# EAGLE schematic flight-controller (EAGLE 7.4.0)
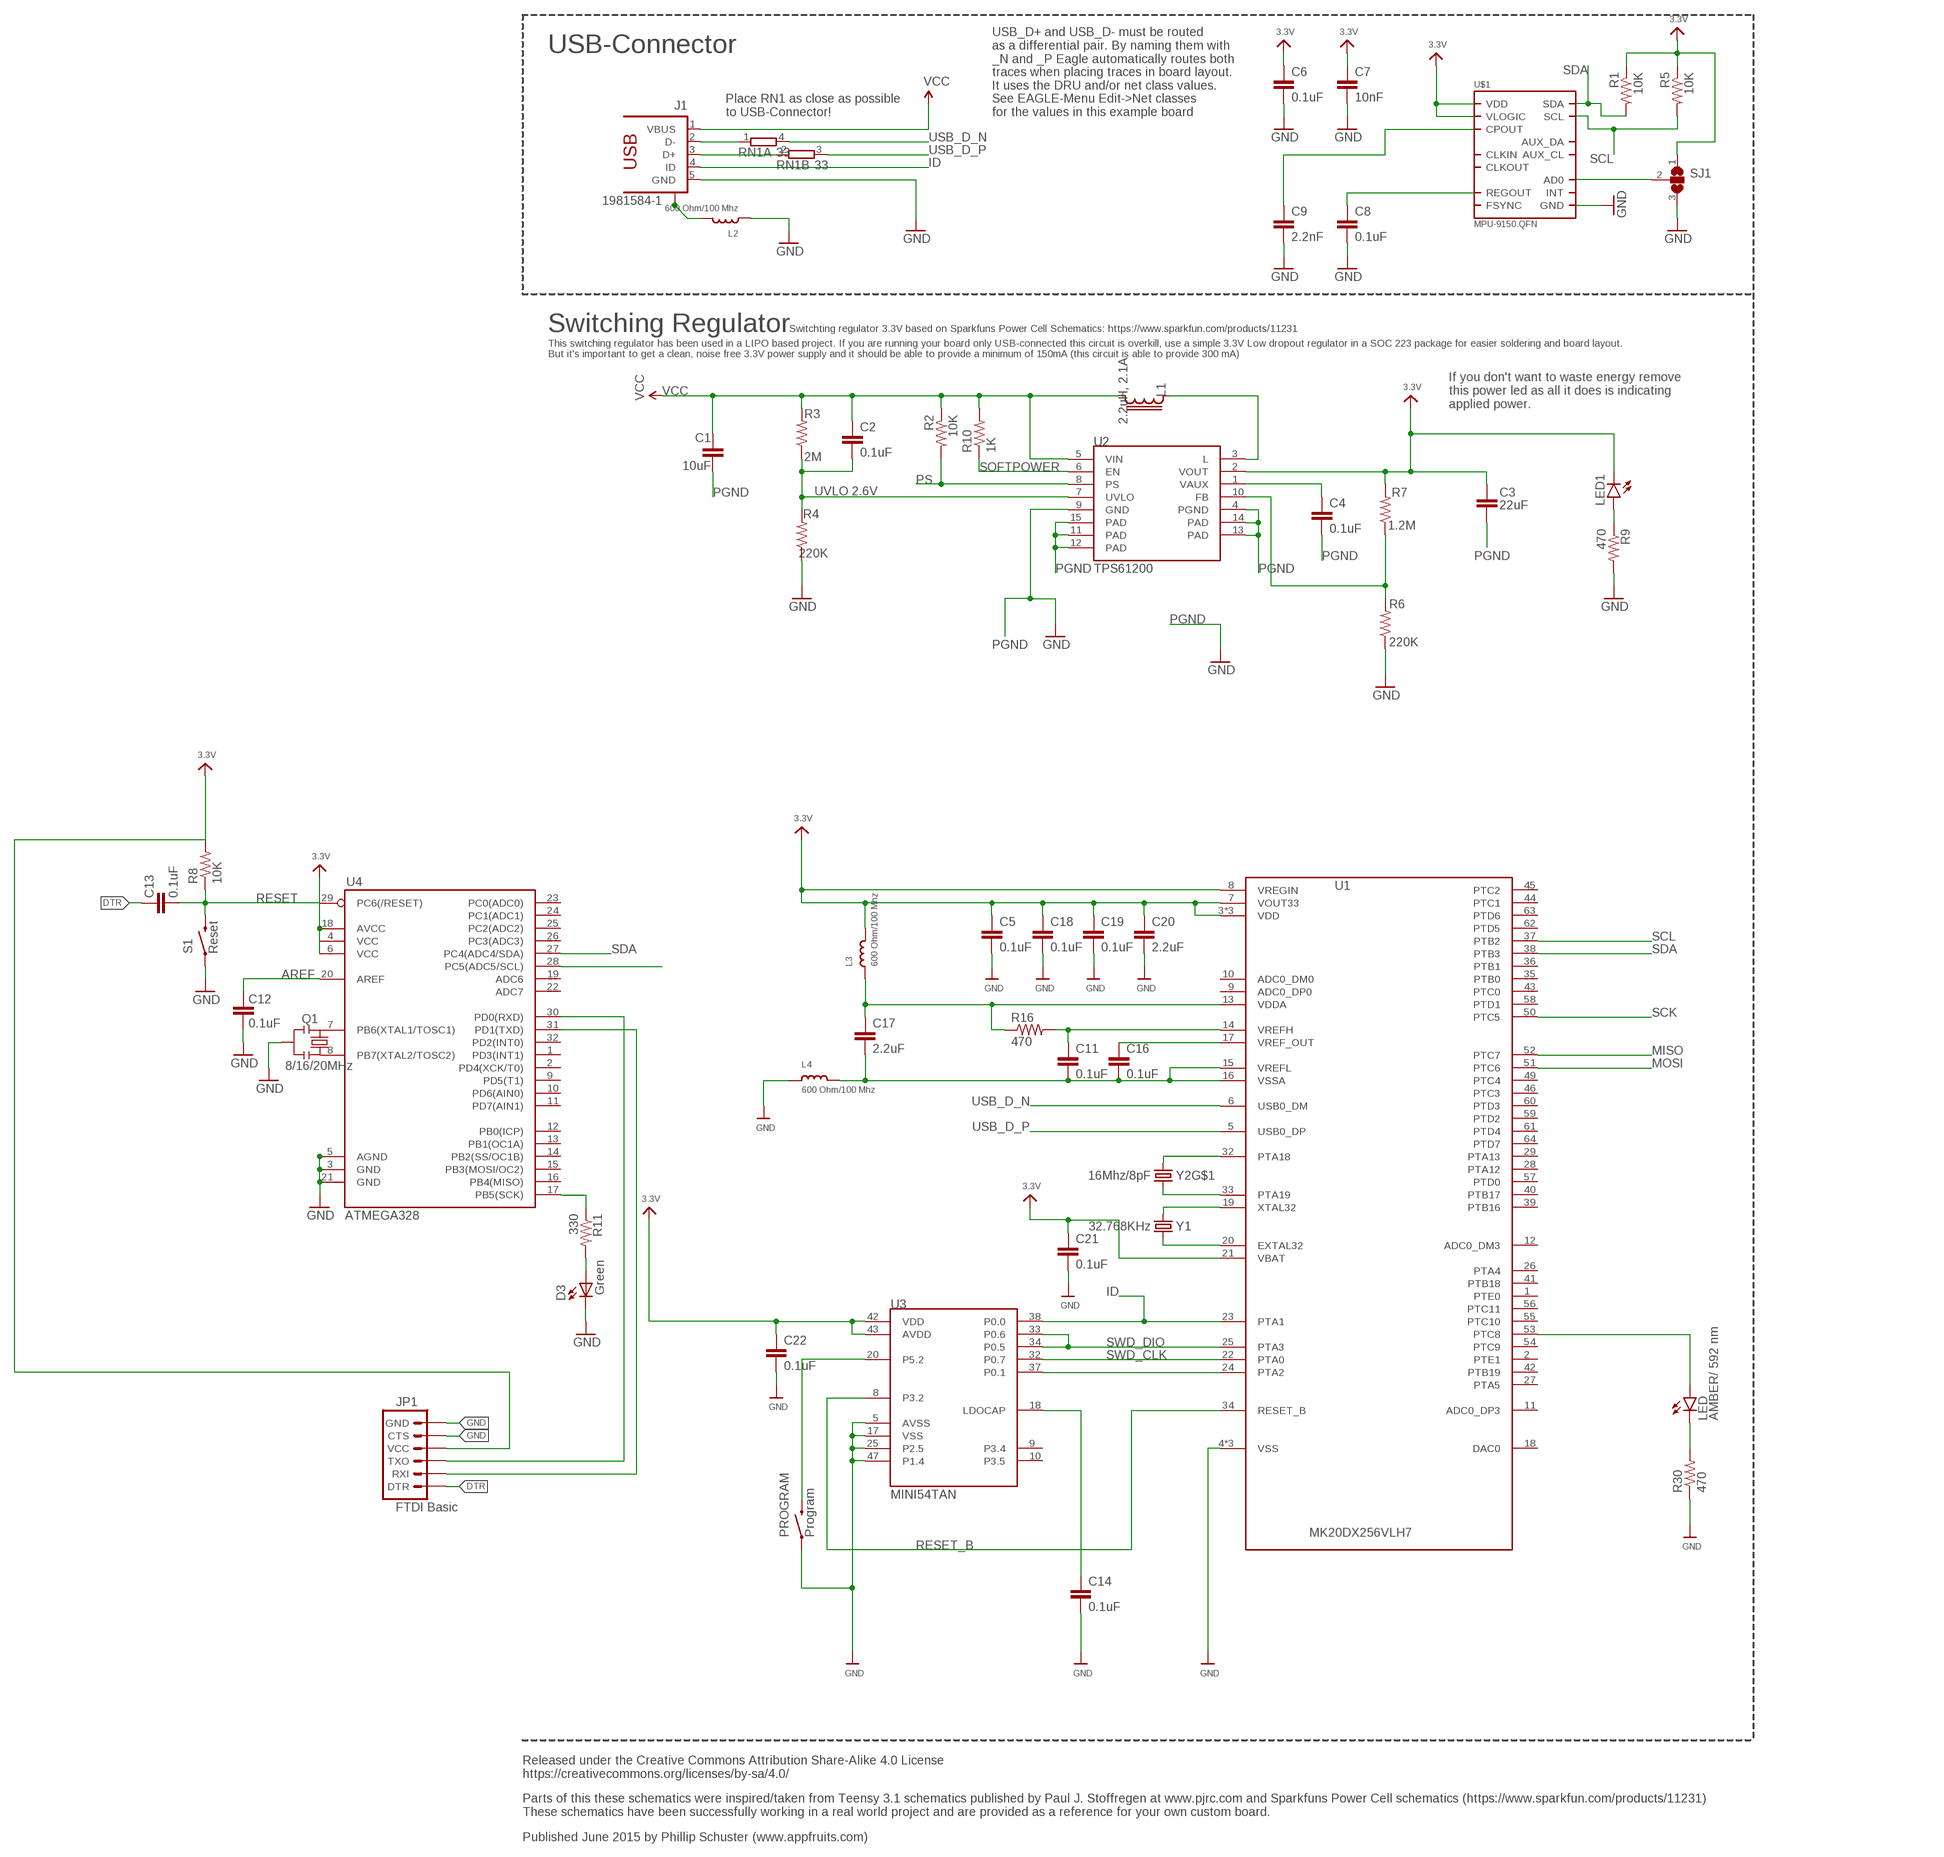
[diagram p0: schematic, sheet 1]

## Parts
C1  10uF  CAPACITOR-10UF  [0603-CAP]
C2  0.1uF  CAPACITOR-0.1UF  [0603-CAP]
C3  22uF  CAPACITOR-22UF  [0603-CAP]
C4  0.1uF  CAPACITOR-0.1UF  [0603-CAP]
C5  0.1uF  CAPACITOR-0.1UF  [0603-CAP]
C6  0.1uF  CAPACITOR-0.1UF  [0603-CAP]
C7  10nF  CAPACITOR-0.1UF  [0603-CAP]
C8  0.1uF  CAPACITOR-0.1UF  [0603-CAP]
C9  2.2nF  CAPACITOR-0.1UF  [0603-CAP]
C11  0.1uF  CAPACITOR-0.1UF  [0603-CAP]
C12  0.1uF  CAP0603-CAP  [0603-CAP]
C13  0.1uF  CAP0603-CAP  [0603-CAP]
C14  0.1uF  CAPACITOR-0.1UF  [0603-CAP]
C16  0.1uF  CAPACITOR-0.1UF  [0603-CAP]
C17  2.2uF  CAPACITOR-2.2UF  [0603-CAP]
C18  0.1uF  CAPACITOR-0.1UF  [0603-CAP]
C19  0.1uF  CAPACITOR-0.1UF  [0603-CAP]
C20  2.2uF  CAPACITOR-2.2UF  [0603-CAP]
C21  0.1uF  CAPACITOR-0.1UF  [0603-CAP]
C22  0.1uF  CAPACITOR-0.1UF  [0603-CAP]
D3  Green  LED  [0603-LED-ALT1]
J1  1981584-1  [1981584-1]
JP1  FTDI Basic  ARDUINO_SERIAL_PROGRAMPTH  [1X06]
L1  2.2uH, 2.1A  LPS30152.2UH  [LPS3015]
L2  600 Ohm/100 Mhz  INDUCTOR-BK2125HM601-T  [0805]
L3  600 Ohm/100 Mhz  INDUCTOR-BK2125HM601-T  [0805]
L4  600 Ohm/100 Mhz  INDUCTOR-BK2125HM601-T  [0805]
LED  AMBER/ 592 nm  LED-AMBER  [LED-0603]
LED1  LED-GREEN  [LED-0603]
PROGRAM  Program  SWITCH-MOMENTARY-2-SMD-1101NE  [TACTILE-SWITCH-1101NE]
Q1  8/16/20MHz  RESONATOR1:1  [RESONATOR-SMD-1:1]
R1  10K  RESISTOR-10K  [0603-RES]
R2  10K  RESISTOR-10K  [0603-RES]
R3  2M  RESISTOR-2M  [0603-RES]
R4  220K  RESISTOR-220K  [0603-RES]
R5  10K  RESISTOR-10K  [0603-RES]
R6  220K  RESISTOR-220K  [0603-RES]
R7  1.2M  RESISTOR-1.2M  [0603-RES]
R8  10K  RESISTOR0603-RES  [0603-RES]
R9  470  RESISTOR-470  [0603-RES]
R10  1K  RESISTOR-1K  [0603-RES]
R11  330  RESISTOR0603-RES  [0603-RES]
R16  470  RESISTOR-470  [0603-RES]
R30  470  RESISTOR-470  [0603-RES]
RN1  33  2R-NEXB34V  [EXB34V]
S1  Reset  SWITCH-MOMENTARY-2SMD-ALT01  [TACTILE-SWITCH-SMD-ALT01]
SJ1  SJ2W  [SJ_2]
U1  MK20DX256VLH7  [MK20DX256VLH7]
U2  TPS61200  [QFN-10_PAD]
U3  MINI54TAN  [MINI54TAN]
U4  ATMEGA328  ATMEGA168  [TQFP32-08]
U$1  MPU-9150.QFN  [QFN.24.4X4]
Y1  32.768KHz  CRYSTAL/32.768KHZ/SMD-TXC_7A  [CRYSTAL-TXC-7A]
Y2  16Mhz/8pF  CRYSTAL/SMD-5X3-GND16MHZ/8PF  [CRYSTAL-SMD-5X3]

## Nets
3.3V: C3.1 C5.1 C6.1 C7.1 C18.1 C19.1 C20.1 C21.1 C22.1 JP1.4(VCC) L3.2 LED1.C R1.1 R5.1 R7.2 R8.2 SJ1.1 U1.3(VDD) U1.7(VOUT33) U1.8(VREGIN) U1.21(VBAT) U1.30(VDD) U1.48(VDD) U2.2(VOUT) U3.42(VDD) U3.43(AVDD) U4.4(VCC) U4.6(VCC) U4.18(AVCC) U$1.3(VDD) U$1.8(VLOGIC) U$1.13(VDD)
AREF: C12.2 U4.20(AREF)
DTR: C13.2 JP1.1(DTR)
FB: R6.2 R7.1 U2.10(FB)
GND [Top GND Pour]: C5.2 C6.2 C7.2 C8.2 C9.2 C12.1 C14.2 C18.2 C19.2 C20.2 C21.2 C22.2 D3.C J1.5(GND) JP1.5(CTS) JP1.6(GND) L2.1 L4.1 PROGRAM.P$1 Q1.2 R4.1 R6.1 R9.2 R30.1 S1.1 S1.2 SJ1.3 U1.4(VSS) U1.31(VSS) U1.47(VSS) U3.5(AVSS) U3.17(VSS) U3.25(P2.5) U3.47(P1.4) U4.3(GND) U4.5(AGND) U4.21(GND) U$1.15(GND) U$1.17(GND) U$1.18(GND)
ID: J1.4(ID) U1.23(PTA1) U3.38(P0.0)
MISO: U1.52(PTC7)
MOSI: U1.51(PTC6)
N$1: LED1.A R9.1
N$2: L1.1 U2.3(L)
N$3: C9.1 U$1.20(CPOUT)
N$4: C8.1 U$1.10(REGOUT)
N$5: SJ1.2 U$1.9(AD0)
N$6: Q1.3 U4.8(PB7(XTAL2/TOSC2))
N$7: D3.A R11.2
N$8: Q1.1 U4.7(PB6(XTAL1/TOSC1))
N$9: JP1.3(TXO) U4.30(PD0(RXD))
N$10: JP1.2(RXI) U4.31(PD1(TXD))
N$12: LED.A U1.53(PTC8)
N$15: U1.24(PTA2) U3.37(P0.1)
N$18: LED.C R30.2
N$19: PROGRAM.P$2 U3.20(P5.2)
N$22: C14.1 U3.18(LDOCAP)
N$27: U1.32(PTA18) Y2.3
N$28: U1.33(PTA19) Y2.1
N$29: U1.19(XTAL32) Y1.P$2
N$30: U1.20(EXTAL32) Y1.P$1
NONE: R11.1 U4.17(PB5(SCK))
PGND: C1.2 C3.2 C4.2 U2.4(PGND) U2.9(GND) U2.11(PAD) U2.12(PAD) U2.13(PAD) U2.14(PAD) U2.15(PAD) ; supply symbol labelled GND
PS: R2.2 U2.8(PS)
RESET: C13.1 R8.1 S1.3 S1.4 U4.29(PC6(/RESET))
RESET_B: U1.34(RESET_B) U3.8(P3.2)
SCK: U1.50(PTC5)
SCL: R5.2 U1.37(PTB2) U4.28(PC5(ADC5/SCL)) U$1.23(SCL)
SDA: R1.2 U1.38(PTB3) U4.27(PC4(ADC4/SDA)) U$1.24(SDA)
SOFTPOWER: R10.1 U2.6(EN)
SWD_CLK: U1.22(PTA0) U3.32(P0.7)
SWD_DIO: U1.25(PTA3) U3.33(P0.6) U3.34(P0.5)
USB_CON_N [USB]: J1.2(D-) RN1.1
USB_CON_P [USB]: J1.3(D+) RN1.2
USB_D_N [USB]: RN1.4 U1.6(USB0_DM)
USB_D_P [USB]: RN1.3 U1.5(USB0_DP)
USB_SHIELD: J1.S1 J1.S2 J1.S3 J1.S4 L2.2
UVLO: C2.2 R3.1 R4.2 U2.7(UVLO)
VAUX: C4.1 U2.1(VAUX)
VCC: C1.1 C2.1 J1.1(VBUS) L1.2 R2.1 R3.2 R10.2 U2.5(VIN)
VDDA: C17.1 L3.1 R16.1 U1.13(VDDA)
VREF_OUT: C16.1 U1.17(VREF_OUT)
VREFH: C11.1 R16.2 U1.14(VREFH)
VREFL: C11.2 C16.2 C17.2 L4.2 U1.15(VREFL) U1.16(VSSA)
Unconnected: U1.1(PTE0) U1.2(PTE1) U1.9(ADC0_DP0) U1.10(ADC0_DM0) U1.11(ADC0_DP3) U1.12(ADC0_DM3) U1.18(DAC0) U1.26(PTA4) U1.27(PTA5) U1.28(PTA12) U1.29(PTA13) U1.35(PTB0) U1.36(PTB1) U1.39(PTB16) U1.40(PTB17) U1.41(PTB18) U1.42(PTB19) U1.43(PTC0) U1.44(PTC1) U1.45(PTC2) U1.46(PTC3) U1.49(PTC4) U1.54(PTC9) U1.55(PTC10) U1.56(PTC11) U1.57(PTD0) U1.58(PTD1) U1.59(PTD2) U1.60(PTD3) U1.61(PTD4) U1.62(PTD5) U1.63(PTD6) U1.64(PTD7) U3.9(P3.4) U3.10(P3.5) U4.1(PD3(INT1)) U4.2(PD4(XCK/T0)) U4.9(PD5(T1)) U4.10(PD6(AIN0)) U4.11(PD7(AIN1)) U4.12(PB0(ICP)) U4.13(PB1(OC1A)) U4.14(PB2(SS/OC1B)) U4.15(PB3(MOSI/OC2)) U4.16(PB4(MISO)) U4.19(ADC6) U4.22(ADC7) U4.23(PC0(ADC0)) U4.24(PC1(ADC1)) U4.25(PC2(ADC2)) U4.26(PC3(ADC3)) U4.32(PD2(INT0)) U$1.1(CLKIN) U$1.6(AUX_DA) U$1.7(AUX_CL) U$1.11(FSYNC) U$1.12(INT) U$1.22(CLKOUT) Y2.2(GND:GND) Y2.4(GND:GND)

## Notes on the sheet
- USB-Connector
- Place RN1 as close as possible
  to USB-Connector!
- USB_D+ and USB_D- must be routed
  as a differential pair. By naming them with
  _N and _P Eagle automatically routes both
  traces when placing traces in board layout.
  It uses the DRU and/or net class values. 
  See EAGLE-Menu Edit->Net classes 
  for the values in this example board
- Switching Regulator | Switchting regulator 3.3V based on Sparkfuns Power Cell Schematics: https://www.sparkfun.com/products/11231
- This switching regulator has been used in a LIPO based project. If you are running your board only USB-connected this circuit is overkill, use a simple 3.3V Low dropout regulator in a SOC 223 package for easier soldering and board layout.
  But it's important to get a clean, noise free 3.3V power supply and it should be able to provide a minimum of 150mA (this circuit is able to provide 300 mA)
- If you don't want to waste energy remove
  this power led as all it does is indicating
  applied power.
- UVLO 2.6V
- Released under the Creative Commons Attribution Share-Alike 4.0 License
  https://creativecommons.org/licenses/by-sa/4.0/
- Parts of this these schematics were inspired/taken from Teensy 3.1 schematics published by Paul J. Stoffregen at www.pjrc.com and Sparkfuns Power Cell schematics (https://www.sparkfun.com/products/11231)
  These schematics have been successfully working in a real world project and are provided as a reference for your own custom board.
- Published June 2015 by Phillip Schuster (www.appfruits.com)

## Library data of the parts
C1 = appfruits:CAPACITOR; MF: Murata; MPN: GRM188R60J106ME47D
C2 C4-C6 C8 C11 C14 C16 C18 C19 C21 C22 = appfruits:CAPACITOR; MF: Kemet; MPN: C0603C104J3RACTU
C3 = appfruits:CAPACITOR; MF: Murata; MPN: GRM188R60J226MEA0D
C7 C9 = appfruits:CAPACITOR; MF: Kemet; MPN: C0603C104J3RACTU; VALUE: 0.1uF
C12 C13 = SparkFun:CAP: Capacitor Standard 0603 ceramic capacitor, and 0.1" leaded capacitor.
C17 C20 = appfruits:CAPACITOR; MF: Kemet; MPN: C0603C225K4PACTU
D3 = Testing:LED: LEDs Standard schematic elements and footprints for 5mm, 3mm, 1206, and 0603 sized LEDs. 5mm - Spark Fun Electronics SKU : COM-00529 (and others)
J1 = con-usb:1981584-1: Receptacle, micro-USB, type A/B Tyco Electronics; MF: Hirose; MPN: ZX62-AB-5PA(11)
JP1 = SparkFun:ARDUINO_SERIAL_PROGRAM
L1 = appfruits:LPS3015: Shielded Power Inductor; MF: Coilcraft; MPN: LPS3015-222MRB
L2-L4 = appfruits:INDUCTOR: Inductors 0603: 10nH Ceramic Inductor - microwire antenna/RF (Digikey: 712-1434-2-ND) 0805: 560nH Ceramic Inductor - RF (Digikey: 553-1047-1-ND) 270nH Ceramic Inductor - Q = 40@250MHz, +-5%, 1 Ohm DC Resistance (Digikey: 535-10506-2-ND) 1007 (2518 Metric) SMT: 10µH 10% 250mOhm 820mA 1007 Inductor (Digikey: 587-2189-1-ND) 22µH 10% 500mOhm 580mA 1007 Inductor (Digikey: 587-2190-1-ND) 47µH 10% 950mOhm 420mA 1007 Inductor (Digikey: 587-2191-1-ND) 47µH 5% 100mOhm 1A 1008 Inductor (Digikey: 732-1816-1-ND) 5.0x5.0mm (Taiyo Yuden NR5040 Series) 6.8µH 20% 2.3A 64mOhm Inductor (Digikey: 587-2374-2-ND) 5.0x5.0mm (TDK VLC5045 Series) 4.7µH 20% 3.3A 34mOhm Inductor (Digikey: 445-6526-1-ND) 6.8µH 20% 2.7A 46mOhm Inductor (Digikey: 445-6527-1-ND) 6.0x6.0mm (TDK VLC6045 Series) 4.7µH 20% 3.8A 27mOhm Inductor (Digikey: 445-6538-2-ND) 6.8µH 20% 3A 41mOhm Inductor (Digikey: 445-6540-1-ND) 6.2µH 30% 2.2A 45mOhm Inductor (Digikey: SRR5028-6R2YCT-ND) - Not TDK VLC6045 but footprint should match 6.0x6.0mm (TDK SLF6045 Series) 6.8uH 30% 2A 33mOhm Inductor (Digikey: 445-4572-1-ND, Mouser: 810-SLF645T6R8N2R0PF) 6.0x6.0mm (Sumida CDRH5D28 Series) 6.2uH 30% 1.8A 45mOhm Inductor (Digikey: 308-1542-1-ND) Taiyo Yuden NR3015T2R2M - 2.2uH 20% 1.5A (Digikey: 587-1648-2-ND, Mouser: 963-NR3015T2R2M) - Used with TI TPS62172 CoilCraft RFID Transponder Coil - MA5532-AE (For use with AS3935 Lightning Sensor); MF: Taiyo Yuden; MPN: BK2125HM601-T
LED = appfruits:LED: LEDs Standard schematic elements and footprints for 5mm, 3mm, 1206, and 0603 sized LEDs. 5mm - Spark Fun Electronics SKU : COM-00529 (and others); MF: Avago Technologies; MPN: HSMA-C190
LED1 = appfruits:LED: LEDs Standard schematic elements and footprints for 5mm, 3mm, 1206, and 0603 sized LEDs. 5mm - Spark Fun Electronics SKU : COM-00529 (and others); MF: Avago; MPN: HSMG-C190
PROGRAM = SparkFun-Electromechanical:SWITCH-MOMENTARY-2: Various NO switches- pushbuttons, reed, etc; MF: C&K Components; MPN: RS-282G05A3-SM RT
Q1 = Testing:RESONATOR: Resonator Small SMD resonator. This is the itty bitty 10/20MHz resonators with built in caps. CSTCE10M0G55 and CSTCE20M0V53. Footprint for SMD has been used in SFE production for years, and does work okay. 1:1 is an attempt to get larger fillets on the sides so it will be easier to inspect these solders in our AOI machine. The pads have been minimized to match the actual metal under the resonator. To see this relation, it includes an image import of the bottom side of the component. Imported to scale on layer 200.
R1 R2 R5 = appfruits:RESISTOR: Resistor Basic schematic elements and footprints for 0603, 1206, and PTH resistors.; MF: Panasonic; MPN: ERJ-3GEYJ103V
R3 = appfruits:RESISTOR: Resistor Basic schematic elements and footprints for 0603, 1206, and PTH resistors.; MF: Panasonic; MPN: ERJ-3GEYJ205V
R4 R6 = appfruits:RESISTOR: Resistor Basic schematic elements and footprints for 0603, 1206, and PTH resistors.; MF: Panasonic; MPN: ERJ-3GEYJ224V
R7 = appfruits:RESISTOR: Resistor Basic schematic elements and footprints for 0603, 1206, and PTH resistors.; MF: Panasonic; MPN: ERJ-3GEYJ125V
R8 R11 = SparkFun:RESISTOR: Resistor Basic schematic elements and footprints for 0603, 1206, and PTH resistors.
R9 R16 R30 = appfruits:RESISTOR: Resistor Basic schematic elements and footprints for 0603, 1206, and PTH resistors.; MF: Panasonic; MPN: ERJ-3GEYJ471V
R10 = appfruits:RESISTOR: Resistor Basic schematic elements and footprints for 0603, 1206, and PTH resistors.; MF: Panasonic; MPN: ERJ-3GEYJ102V
RN1 = resistor-dil:2R-N: Array Chip Resistor Source: Panasonic; MF: Panasonic; MPN: EXB-34V330JV; OC_FARNELL: unknown; OC_NEWARK: unknown
S1 = Testing:SWITCH-MOMENTARY-2: Various NO switches- pushbuttons, reed, etc
SJ1 = jumper:SJ2W: SMD solder JUMPER
U1 = appfruits:MK20DX256VLH7; MF: Freescale; MPN: MK20DX256VLH7
U2 = appfruits:TPS61200: DC to DC Booster IC-10035; MF: Texas Instruments; MPN: TPS61200DRCR; PROD_ID: IC-10035
U3 = TeensyCustom:MINI54TAN: MINI54TAN Bootloader from PJRC.com, preprogrammed with Teensy 3.0 bootloader. https://www.pjrc.com/store/ic_mini54_tqfp.html
U4 = SparkFun:ATMEGA168
U$1 = invensense:MPU-9150
Y1 = appfruits:CRYSTAL/32.768KHZ/SMD-TXC_7A; MF: Epson Timing; MPN: FC-255 32.7680K-A3
Y2 = appfruits:CRYSTAL/SMD-5X3-GND; MF: ECS; MPN: ECS-160-8-30B-CKM

## Net classes
1 USB: width 0.254 mm, drill 0.33 mm, clearance 0.159 mm
2 Top GND Pour: clearance 0.762 mm to class 1